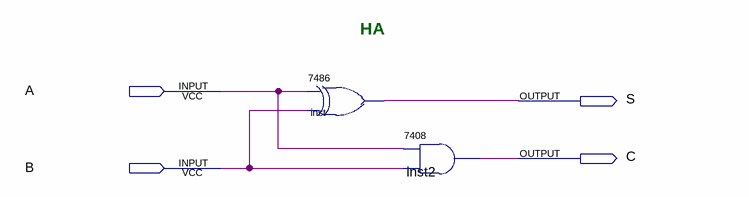
[diagram p0: schematic sheet]
// Quartus schematic HA.bdf as structural Verilog: 2 symbols, 4 pins
module HA (
  input  A,
  input  B,
  output S,
  output C
);

  \7486  inst (.\2 (A), .\3 (B), .\1 (S));
  \7408  inst2 (.\3 (B), .\2 (A), .\1 (C));

  // Notes on the sheet:
  //   HA
endmodule
